# EAGLE schematic Order (EAGLE 9.5.0)
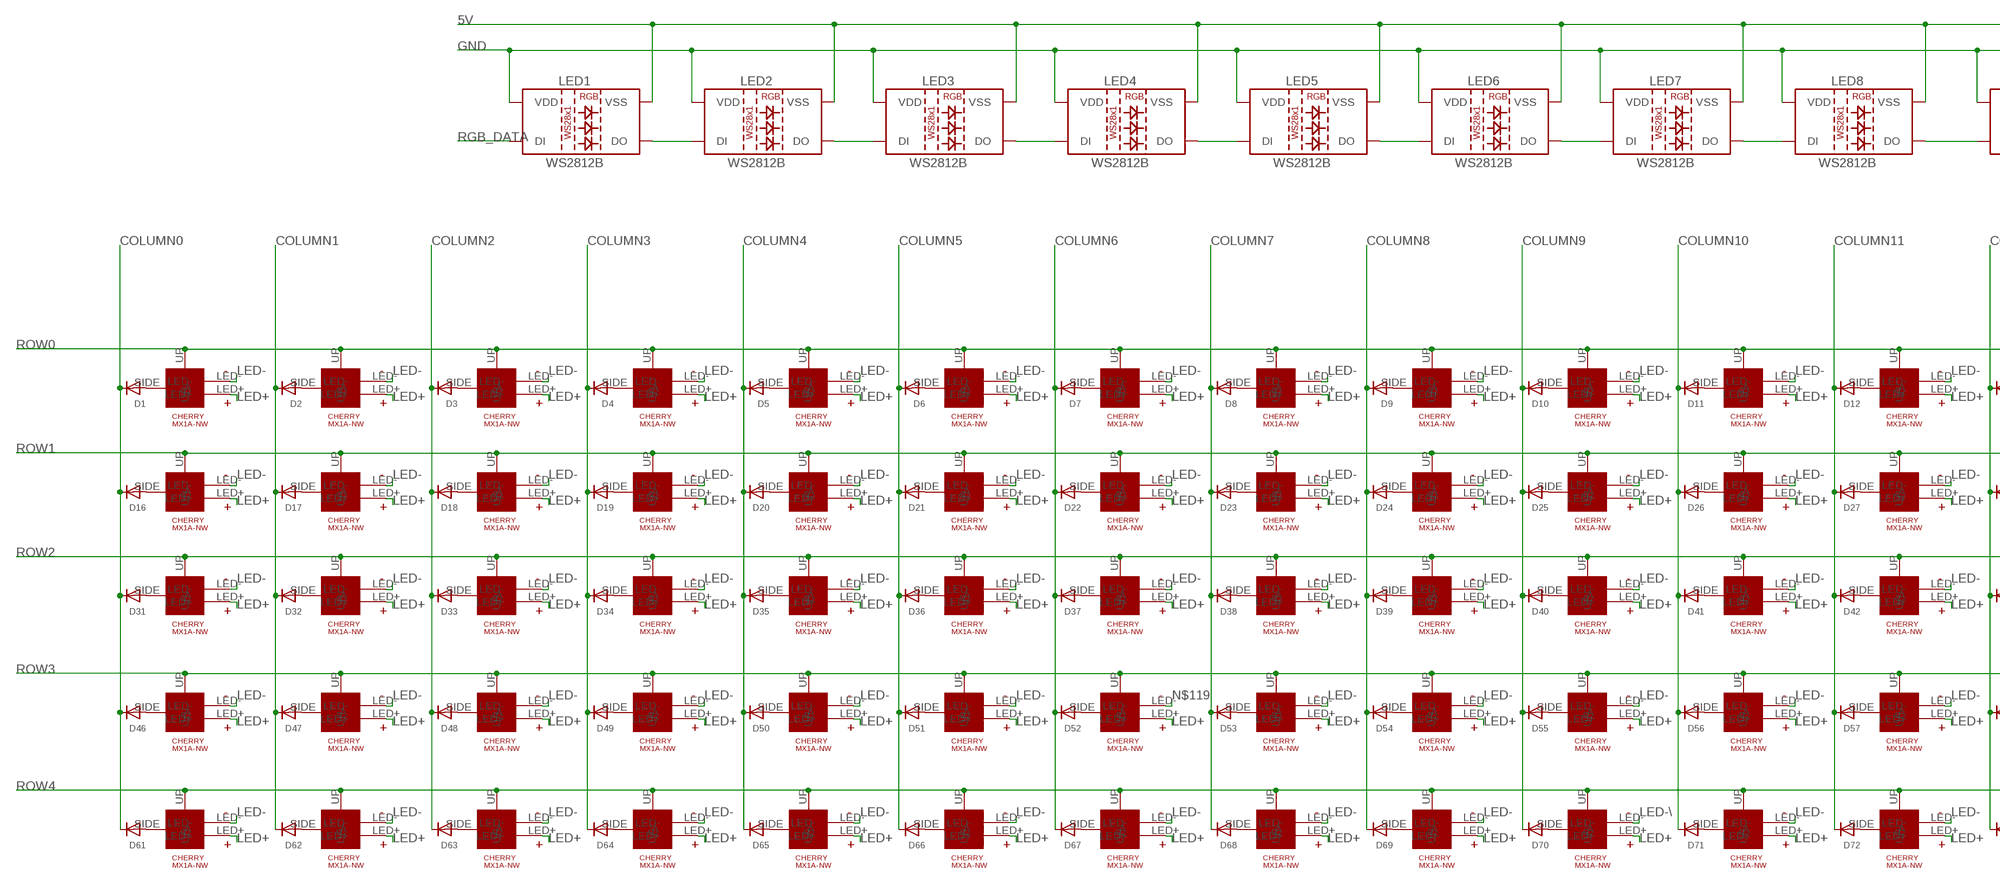
[diagram p0: schematic, sheet 1, part 1 of 2]
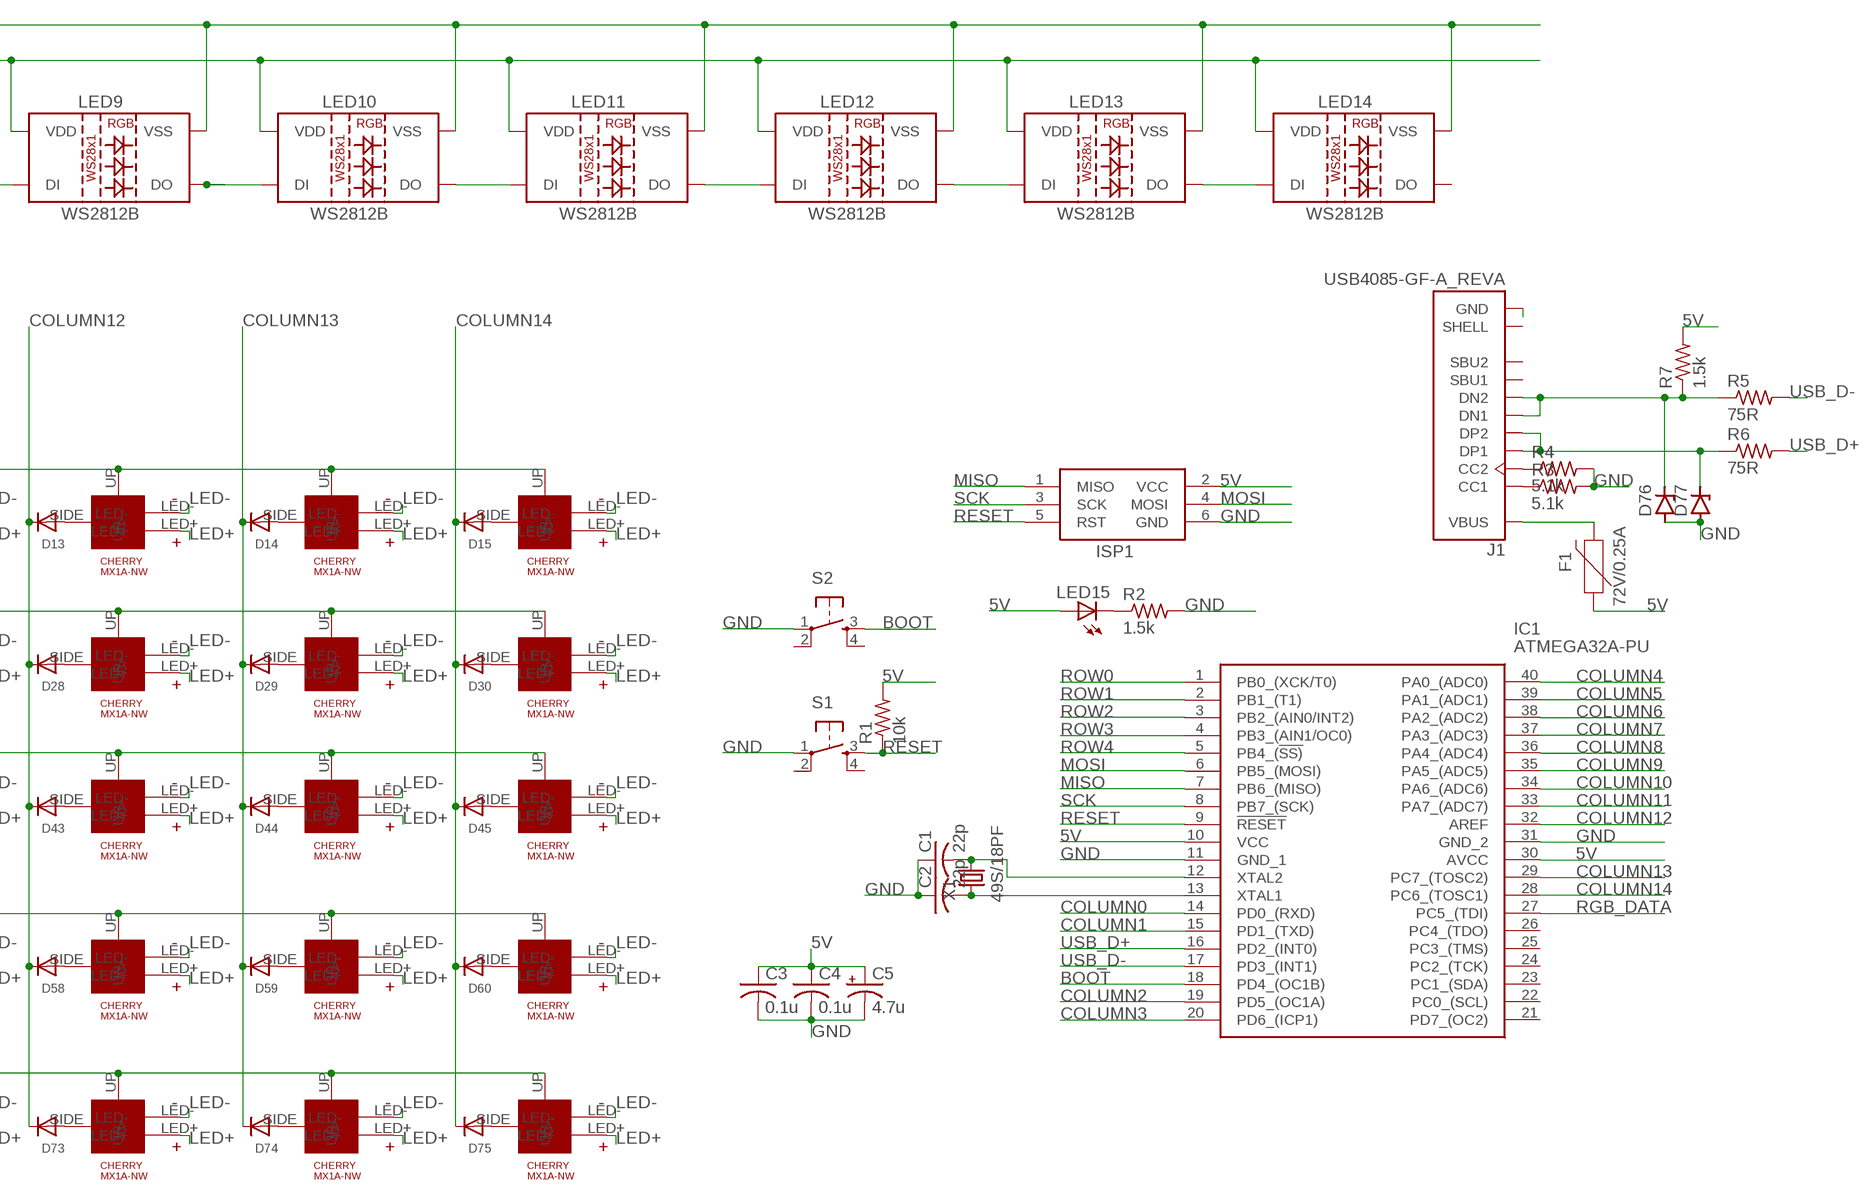
[diagram p1: schematic, sheet 1, part 2 of 2]

## Parts
C1  22p  C-US025-025X050  [C025-025X050]
C2  22p  C-US025-025X050  [C025-025X050]
C3  0.1u  C-US025-025X050  [C025-025X050]
C4  0.1u  C-US025-025X050  [C025-025X050]
C5  4.7u  CPOL-USE2-4  [E2-4]
D1  DIODEDO-1N4148  [DO-1N4148]
D2  DIODEDO-1N4148  [DO-1N4148]
D3  DIODEDO-1N4148  [DO-1N4148]
D4  DIODEDO-1N4148  [DO-1N4148]
D5  DIODEDO-1N4148  [DO-1N4148]
D6  DIODEDO-1N4148  [DO-1N4148]
D7  DIODEDO-1N4148  [DO-1N4148]
D8  DIODEDO-1N4148  [DO-1N4148]
D9  DIODEDO-1N4148  [DO-1N4148]
D10  DIODEDO-1N4148  [DO-1N4148]
D11  DIODEDO-1N4148  [DO-1N4148]
D12  DIODEDO-1N4148  [DO-1N4148]
D13  DIODEDO-1N4148  [DO-1N4148]
D14  DIODEDO-1N4148  [DO-1N4148]
D15  DIODEDO-1N4148  [DO-1N4148]
D16  DIODEDO-1N4148  [DO-1N4148]
D17  DIODEDO-1N4148  [DO-1N4148]
D18  DIODEDO-1N4148  [DO-1N4148]
D19  DIODEDO-1N4148  [DO-1N4148]
D20  DIODEDO-1N4148  [DO-1N4148]
D21  DIODEDO-1N4148  [DO-1N4148]
D22  DIODEDO-1N4148  [DO-1N4148]
D23  DIODEDO-1N4148  [DO-1N4148]
D24  DIODEDO-1N4148  [DO-1N4148]
D25  DIODEDO-1N4148  [DO-1N4148]
D26  DIODEDO-1N4148  [DO-1N4148]
D27  DIODEDO-1N4148  [DO-1N4148]
D28  DIODEDO-1N4148  [DO-1N4148]
D29  DIODEDO-1N4148  [DO-1N4148]
D30  DIODEDO-1N4148  [DO-1N4148]
D31  DIODEDO-1N4148  [DO-1N4148]
D32  DIODEDO-1N4148  [DO-1N4148]
D33  DIODEDO-1N4148  [DO-1N4148]
D34  DIODEDO-1N4148  [DO-1N4148]
D35  DIODEDO-1N4148  [DO-1N4148]
D36  DIODEDO-1N4148  [DO-1N4148]
D37  DIODEDO-1N4148  [DO-1N4148]
D38  DIODEDO-1N4148  [DO-1N4148]
D39  DIODEDO-1N4148  [DO-1N4148]
D40  DIODEDO-1N4148  [DO-1N4148]
D41  DIODEDO-1N4148  [DO-1N4148]
D42  DIODEDO-1N4148  [DO-1N4148]
D43  DIODEDO-1N4148  [DO-1N4148]
D44  DIODEDO-1N4148  [DO-1N4148]
D45  DIODEDO-1N4148  [DO-1N4148]
D46  DIODEDO-1N4148  [DO-1N4148]
D47  DIODEDO-1N4148  [DO-1N4148]
D48  DIODEDO-1N4148  [DO-1N4148]
D49  DIODEDO-1N4148  [DO-1N4148]
D50  DIODEDO-1N4148  [DO-1N4148]
D51  DIODEDO-1N4148  [DO-1N4148]
D52  DIODEDO-1N4148  [DO-1N4148]
D53  DIODEDO-1N4148  [DO-1N4148]
D54  DIODEDO-1N4148  [DO-1N4148]
D55  DIODEDO-1N4148  [DO-1N4148]
D56  DIODEDO-1N4148  [DO-1N4148]
D57  DIODEDO-1N4148  [DO-1N4148]
D58  DIODEDO-1N4148  [DO-1N4148]
D59  DIODEDO-1N4148  [DO-1N4148]
D60  DIODEDO-1N4148  [DO-1N4148]
D61  DIODEDO-1N4148  [DO-1N4148]
D62  DIODEDO-1N4148  [DO-1N4148]
D63  DIODEDO-1N4148  [DO-1N4148]
D64  DIODEDO-1N4148  [DO-1N4148]
D65  DIODEDO-1N4148  [DO-1N4148]
D66  DIODEDO-1N4148  [DO-1N4148]
D67  DIODEDO-1N4148  [DO-1N4148]
D68  DIODEDO-1N4148  [DO-1N4148]
D69  DIODEDO-1N4148  [DO-1N4148]
D70  DIODEDO-1N4148  [DO-1N4148]
D71  DIODEDO-1N4148  [DO-1N4148]
D72  DIODEDO-1N4148  [DO-1N4148]
D73  DIODEDO-1N4148  [DO-1N4148]
D74  DIODEDO-1N4148  [DO-1N4148]
D75  DIODEDO-1N4148  [DO-1N4148]
D76  ZENER-DIODEDO34-7  [DO34Z7]
D77  ZENER-DIODEDO34-7  [DO34Z7]
F1  72V/0.25A  PPTC_PTH  [PTH]
IC1  ATMEGA32A-PU  [DIP1556W56P254L5232H483Q40N]
ISP1  AVRISP-6  [AVRISP]
J1  USB4085-GF-A_REVA  [GCT_USB4085-GF-A_REVA]
LED1  WS2812B  [WS2812B]
LED2  WS2812B  [WS2812B]
LED3  WS2812B  [WS2812B]
LED4  WS2812B  [WS2812B]
LED5  WS2812B  [WS2812B]
LED6  WS2812B  [WS2812B]
LED7  WS2812B  [WS2812B]
LED8  WS2812B  [WS2812B]
LED9  WS2812B  [WS2812B]
LED10  WS2812B  [WS2812B]
LED11  WS2812B  [WS2812B]
LED12  WS2812B  [WS2812B]
LED13  WS2812B  [WS2812B]
LED14  WS2812B  [WS2812B]
LED15  LED3MM  [LED3MM]
R1  10k  R-US_0207/9  [0207/9]
R2  1.5k  R-US_0207/9  [0207/9]
R3  5.1k  R-US_0207/9  [0207/9]
R4  5.1k  R-US_0207/9  [0207/9]
R5  75R  R-US_0207/9  [0207/9]
R6  75R  R-US_0207/9  [0207/9]
R7  1.5k  R-US_0207/9  [0207/9]
S1  TAC_SWITCHPTH  [TACTILE-PTH]
S2  TAC_SWITCHPTH  [TACTILE-PTH]
U$1  CHERRY-MX1A-E1NW-LED  [CHERRYMX-NN-LED]
U$2  CHERRY-MX1A-E1NW-LED  [CHERRYMX-NN-LED]
U$3  CHERRY-MX1A-E1NW-LED  [CHERRYMX-NN-LED]
U$4  CHERRY-MX1A-E1NW-LED  [CHERRYMX-NN-LED]
U$5  CHERRY-MX1A-E1NW-LED  [CHERRYMX-NN-LED]
U$6  CHERRY-MX1A-E1NW-LED  [CHERRYMX-NN-LED]
U$7  CHERRY-MX1A-E1NW-LED  [CHERRYMX-NN-LED]
U$8  CHERRY-MX1A-E1NW-LED  [CHERRYMX-NN-LED]
U$9  CHERRY-MX1A-E1NW-LED  [CHERRYMX-NN-LED]
U$10  CHERRY-MX1A-E1NW-LED  [CHERRYMX-NN-LED]
U$11  CHERRY-MX1A-E1NW-LED  [CHERRYMX-NN-LED]
U$12  CHERRY-MX1A-E1NW-LED  [CHERRYMX-NN-LED]
U$13  CHERRY-MX1A-E1NW-LED  [CHERRYMX-NN-LED]
U$14  CHERRY-MX1A-E1NW-LED  [CHERRYMX-NN-LED]
U$15  CHERRY-MX1A-E1NW-LED  [CHERRYMX-NN-LED]
U$16  CHERRY-MX1A-E1NW-LED  [CHERRYMX-NN-LED]
U$17  CHERRY-MX1A-E1NW-LED  [CHERRYMX-NN-LED]
U$18  CHERRY-MX1A-E1NW-LED  [CHERRYMX-NN-LED]
U$19  CHERRY-MX1A-E1NW-LED  [CHERRYMX-NN-LED]
U$20  CHERRY-MX1A-E1NW-LED  [CHERRYMX-NN-LED]
U$21  CHERRY-MX1A-E1NW-LED  [CHERRYMX-NN-LED]
U$22  CHERRY-MX1A-E1NW-LED  [CHERRYMX-NN-LED]
U$23  CHERRY-MX1A-E1NW-LED  [CHERRYMX-NN-LED]
U$24  CHERRY-MX1A-E1NW-LED  [CHERRYMX-NN-LED]
U$25  CHERRY-MX1A-E1NW-LED  [CHERRYMX-NN-LED]
U$26  CHERRY-MX1A-E1NW-LED  [CHERRYMX-NN-LED]
U$27  CHERRY-MX1A-E1NW-LED  [CHERRYMX-NN-LED]
U$28  CHERRY-MX1A-E1NW-LED  [CHERRYMX-NN-LED]
U$29  CHERRY-MX1A-E1NW-LED  [CHERRYMX-NN-LED]
U$30  CHERRY-MX1A-E1NW-LED  [CHERRYMX-NN-LED]
U$31  CHERRY-MX1A-E1NW-LED  [CHERRYMX-NN-LED]
U$32  CHERRY-MX1A-E1NW-LED  [CHERRYMX-NN-LED]
U$33  CHERRY-MX1A-E1NW-LED  [CHERRYMX-NN-LED]
U$34  CHERRY-MX1A-E1NW-LED  [CHERRYMX-NN-LED]
U$35  CHERRY-MX1A-E1NW-LED  [CHERRYMX-NN-LED]
U$36  CHERRY-MX1A-E1NW-LED  [CHERRYMX-NN-LED]
U$37  CHERRY-MX1A-E1NW-LED  [CHERRYMX-NN-LED]
U$38  CHERRY-MX1A-E1NW-LED  [CHERRYMX-NN-LED]
U$39  CHERRY-MX1A-E1NW-LED  [CHERRYMX-NN-LED]
U$40  CHERRY-MX1A-E1NW-LED  [CHERRYMX-NN-LED]
U$41  CHERRY-MX1A-E1NW-LED  [CHERRYMX-NN-LED]
U$42  CHERRY-MX1A-E1NW-LED  [CHERRYMX-NN-LED]
U$43  CHERRY-MX1A-E1NW-LED  [CHERRYMX-NN-LED]
U$44  CHERRY-MX1A-E1NW-LED  [CHERRYMX-NN-LED]
U$45  CHERRY-MX1A-E1NW-LED  [CHERRYMX-NN-LED]
U$46  CHERRY-MX1A-E1NW-LED  [CHERRYMX-NN-LED]
U$47  CHERRY-MX1A-E1NW-LED  [CHERRYMX-NN-LED]
U$48  CHERRY-MX1A-E1NW-LED  [CHERRYMX-NN-LED]
U$49  CHERRY-MX1A-E1NW-LED  [CHERRYMX-NN-LED]
U$50  CHERRY-MX1A-E1NW-LED  [CHERRYMX-NN-LED]
U$51  CHERRY-MX1A-E1NW-LED  [CHERRYMX-NN-LED]
U$52  CHERRY-MX1A-E1NW-LED  [CHERRYMX-NN-LED]
U$53  CHERRY-MX1A-E1NW-LED  [CHERRYMX-NN-LED]
U$54  CHERRY-MX1A-E1NW-LED  [CHERRYMX-NN-LED]
U$55  CHERRY-MX1A-E1NW-LED  [CHERRYMX-NN-LED]
U$56  CHERRY-MX1A-E1NW-LED  [CHERRYMX-NN-LED]
U$57  CHERRY-MX1A-E1NW-LED  [CHERRYMX-NN-LED]
U$58  CHERRY-MX1A-E1NW-LED  [CHERRYMX-NN-LED]
U$59  CHERRY-MX1A-E1NW-LED  [CHERRYMX-NN-LED]
U$60  CHERRY-MX1A-E1NW-LED  [CHERRYMX-NN-LED]
U$61  CHERRY-MX1A-E1NW-LED  [CHERRYMX-NN-LED]
U$62  CHERRY-MX1A-E1NW-LED  [CHERRYMX-NN-LED]
U$63  CHERRY-MX1A-E1NW-LED  [CHERRYMX-NN-LED]
U$64  CHERRY-MX1A-E1NW-LED  [CHERRYMX-NN-LED]
U$65  CHERRY-MX1A-E1NW-LED  [CHERRYMX-NN-LED]
U$66  CHERRY-MX1A-E1NW-LED  [CHERRYMX-NN-LED]
U$67  CHERRY-MX1A-E1NW-LED  [CHERRYMX-NN-LED]
U$68  CHERRY-MX1A-E1NW-LED  [CHERRYMX-NN-LED]
U$69  CHERRY-MX1A-E1NW-LED  [CHERRYMX-NN-LED]
U$70  CHERRY-MX1A-E1NW-LED  [CHERRYMX-NN-LED]
U$71  CHERRY-MX1A-E1NW-LED  [CHERRYMX-NN-LED]
U$72  CHERRY-MX1A-E1NW-LED  [CHERRYMX-NN-LED]
U$73  CHERRY-MX1A-E1NW-LED  [CHERRYMX-NN-LED]
U$74  CHERRY-MX1A-E1NW-LED  [CHERRYMX-NN-LED]
U$75  CHERRY-MX1A-E1NW-LED  [CHERRYMX-NN-LED]
X1  49S/18PF  [XTAL_HC49]

## Nets
5V: C3.1 C4.1 C5.+ F1.P$1 IC1.10(VCC) IC1.30(AVCC) ISP1.2(VCC) LED1.3(VSS) LED2.3(VSS) LED3.3(VSS) LED4.3(VSS) LED5.3(VSS) LED6.3(VSS) LED7.3(VSS) LED8.3(VSS) LED9.3(VSS) LED10.3(VSS) LED11.3(VSS) LED12.3(VSS) LED13.3(VSS) LED14.3(VSS) LED15.A R1.2 R7.2
BOOT: IC1.18(PD4_(OC1B)) S2.3
COLUMN0: D1.C D16.C D31.C D46.C D61.C IC1.14(PD0_(RXD))
COLUMN1: D2.C D17.C D32.C D47.C D62.C IC1.15(PD1_(TXD))
COLUMN2: D3.C D18.C D33.C D48.C D63.C IC1.19(PD5_(OC1A))
COLUMN3: D4.C D19.C D34.C D49.C D64.C IC1.20(PD6_(ICP1))
COLUMN4: D5.C D20.C D35.C D50.C D65.C IC1.40(PA0_(ADC0))
COLUMN5: D6.C D21.C D36.C D51.C D66.C IC1.39(PA1_(ADC1))
COLUMN6: D7.C D22.C D37.C D52.C D67.C IC1.38(PA2_(ADC2))
COLUMN7: D8.C D23.C D38.C D53.C D68.C IC1.37(PA3_(ADC3))
COLUMN8: D9.C D24.C D39.C D54.C D69.C IC1.36(PA4_(ADC4))
COLUMN9: D10.C D25.C D40.C D55.C D70.C IC1.35(PA5_(ADC5))
COLUMN10: D11.C D26.C D41.C D56.C D71.C IC1.34(PA6_(ADC6))
COLUMN11: D12.C D27.C D42.C D57.C D72.C IC1.33(PA7_(ADC7))
COLUMN12: D13.C D28.C D43.C D58.C D73.C IC1.32(AREF)
COLUMN13: D14.C D29.C D44.C D59.C D74.C IC1.29(PC7_(TOSC2))
COLUMN14: D15.C D30.C D45.C D60.C D75.C IC1.28(PC6_(TOSC1))
GND: C1.1 C2.1 C3.2 C4.2 C5.- D76.A D77.A IC1.11(GND_1) IC1.31(GND_2) ISP1.6(GND) LED1.1(VDD) LED2.1(VDD) LED3.1(VDD) LED4.1(VDD) LED5.1(VDD) LED6.1(VDD) LED7.1(VDD) LED8.1(VDD) LED9.1(VDD) LED10.1(VDD) LED11.1(VDD) LED12.1(VDD) LED13.1(VDD) LED14.1(VDD) R2.2 R3.2 R4.2 S1.1 S2.1
LED+: U$1.LED+ U$2.LED+ U$3.LED+ U$4.LED+ U$5.LED+ U$6.LED+ U$7.LED+ U$8.LED+ U$9.LED+ U$10.LED+ U$11.LED+ U$12.LED+ U$13.LED+ U$14.LED+ U$15.LED+ U$16.LED+ U$17.LED+ U$18.LED+ U$19.LED+ U$20.LED+ U$21.LED+ U$22.LED+ U$23.LED+ U$24.LED+ U$25.LED+ U$26.LED+ U$27.LED+ U$28.LED+ U$29.LED+ U$30.LED+ U$31.LED+ U$32.LED+ U$33.LED+ U$34.LED+ U$35.LED+ U$36.LED+ U$37.LED+ U$38.LED+ U$39.LED+ U$40.LED+ U$41.LED+ U$42.LED+ U$43.LED+ U$44.LED+ U$45.LED+ U$46.LED+ U$47.LED+ U$48.LED+ U$49.LED+ U$50.LED+ U$51.LED+ U$52.LED+ U$53.LED+ U$54.LED+ U$55.LED+ U$56.LED+ U$57.LED+ U$58.LED+ U$59.LED+ U$60.LED+ U$61.LED+ U$62.LED+ U$63.LED+ U$64.LED+ U$65.LED+ U$66.LED+ U$67.LED+ U$68.LED+ U$69.LED+ U$70.LED+ U$71.LED+ U$72.LED+ U$73.LED+ U$74.LED+ U$75.LED+
LED-: U$1.LED- U$2.LED- U$3.LED- U$4.LED- U$5.LED- U$6.LED- U$7.LED- U$8.LED- U$9.LED- U$10.LED- U$11.LED- U$12.LED- U$13.LED- U$14.LED- U$15.LED- U$16.LED- U$17.LED- U$18.LED- U$19.LED- U$20.LED- U$21.LED- U$22.LED- U$23.LED- U$24.LED- U$25.LED- U$26.LED- U$27.LED- U$28.LED- U$29.LED- U$30.LED- U$31.LED- U$32.LED- U$33.LED- U$34.LED- U$35.LED- U$36.LED- U$37.LED- U$38.LED- U$39.LED- U$40.LED- U$41.LED- U$42.LED- U$43.LED- U$44.LED- U$45.LED- U$46.LED- U$47.LED- U$48.LED- U$49.LED- U$50.LED- U$51.LED- U$53.LED- U$54.LED- U$55.LED- U$56.LED- U$57.LED- U$58.LED- U$59.LED- U$60.LED- U$61.LED- U$62.LED- U$63.LED- U$64.LED- U$65.LED- U$66.LED- U$67.LED- U$68.LED- U$69.LED- U$71.LED- U$72.LED- U$73.LED- U$74.LED- U$75.LED-
LED-\: U$70.LED-
MISO: IC1.7(PB6_(MISO)) ISP1.1(MISO)
MOSI: IC1.6(PB5_(MOSI)) ISP1.4(MOSI)
N$1: D1.A U$1.SIDE(A)
N$2: D2.A U$2.SIDE(A)
N$3: D3.A U$3.SIDE(A)
N$4: D4.A U$4.SIDE(A)
N$5: D5.A U$5.SIDE(A)
N$6: D6.A U$6.SIDE(A)
N$7: D7.A U$7.SIDE(A)
N$8: D8.A U$8.SIDE(A)
N$9: D9.A U$9.SIDE(A)
N$10: D10.A U$10.SIDE(A)
N$11: D11.A U$11.SIDE(A)
N$12: D12.A U$12.SIDE(A)
N$13: D13.A U$13.SIDE(A)
N$14: D14.A U$14.SIDE(A)
N$15: D15.A U$15.SIDE(A)
N$16: D16.A U$16.SIDE(A)
N$17: D17.A U$17.SIDE(A)
N$18: D18.A U$18.SIDE(A)
N$19: D19.A U$19.SIDE(A)
N$20: D20.A U$20.SIDE(A)
N$21: D21.A U$21.SIDE(A)
N$22: D22.A U$22.SIDE(A)
N$23: D23.A U$23.SIDE(A)
N$24: D24.A U$24.SIDE(A)
N$25: D25.A U$25.SIDE(A)
N$26: D26.A U$26.SIDE(A)
N$27: D27.A U$27.SIDE(A)
N$28: D28.A U$28.SIDE(A)
N$29: D29.A U$29.SIDE(A)
N$30: D30.A U$30.SIDE(A)
N$31: D31.A U$31.SIDE(A)
N$32: D32.A U$32.SIDE(A)
N$33: D33.A U$33.SIDE(A)
N$34: D34.A U$34.SIDE(A)
N$35: D35.A U$35.SIDE(A)
N$36: D36.A U$36.SIDE(A)
N$37: D37.A U$37.SIDE(A)
N$38: D38.A U$38.SIDE(A)
N$39: D39.A U$39.SIDE(A)
N$40: D40.A U$40.SIDE(A)
N$41: LED1.2(DO) LED2.4(DI)
N$42: LED2.2(DO) LED3.4(DI)
N$43: C1.2 IC1.12(XTAL2) X1.2
N$44: C2.2 IC1.13(XTAL1) X1.1
N$45: LED15.K(C) R2.1
N$46: LED3.2(DO) LED4.4(DI)
N$47: LED4.2(DO) LED5.4(DI)
N$48: LED5.2(DO) LED6.4(DI)
N$49: LED6.2(DO) LED7.4(DI)
N$50: LED7.2(DO) LED8.4(DI)
N$51: LED8.2(DO) LED9.4(DI)
N$52: LED9.2(DO) LED10.4(DI)
N$53: LED10.2(DO) LED11.4(DI)
N$54: D41.A U$41.SIDE(A)
N$55: D42.A U$42.SIDE(A)
N$56: D43.A U$43.SIDE(A)
N$57: D44.A U$44.SIDE(A)
N$58: D45.A U$45.SIDE(A)
N$59: D46.A U$46.SIDE(A)
N$60: D47.A U$47.SIDE(A)
N$61: D48.A U$48.SIDE(A)
N$62: D49.A U$49.SIDE(A)
N$63: D50.A U$50.SIDE(A)
N$64: D51.A U$51.SIDE(A)
N$65: D52.A U$52.SIDE(A)
N$66: D53.A U$53.SIDE(A)
N$67: D54.A U$54.SIDE(A)
N$68: D55.A U$55.SIDE(A)
N$69: D56.A U$56.SIDE(A)
N$70: D57.A U$57.SIDE(A)
N$71: D58.A U$58.SIDE(A)
N$72: D59.A U$59.SIDE(A)
N$73: D60.A U$60.SIDE(A)
N$74: D61.A U$61.SIDE(A)
N$75: D62.A U$62.SIDE(A)
N$76: D63.A U$63.SIDE(A)
N$77: D64.A U$64.SIDE(A)
N$78: D65.A U$65.SIDE(A)
N$79: D66.A U$66.SIDE(A)
N$80: D67.A U$67.SIDE(A)
N$81: D68.A U$68.SIDE(A)
N$82: D69.A U$69.SIDE(A)
N$83: D70.A U$70.SIDE(A)
N$84: D71.A U$71.SIDE(A)
N$85: D72.A U$72.SIDE(A)
N$86: D73.A U$73.SIDE(A)
N$87: D74.A U$74.SIDE(A)
N$88: D75.A U$75.SIDE(A)
N$89: LED11.2(DO) LED12.4(DI)
N$90: LED12.2(DO) LED13.4(DI)
N$91: LED13.2(DO) LED14.4(DI)
N$92: J1.A1(GND) J1.A12(GND) J1.B1(GND) J1.B12(GND)
N$93: F1.P$2 J1.A4(VBUS) J1.A9(VBUS) J1.B4(VBUS) J1.B9(VBUS)
N$94: J1.P1(SHELL) J1.P2(SHELL) J1.P3(SHELL) J1.P4(SHELL)
N$95: J1.A5(CC1) R3.1
N$96: D76.C J1.A7(DN1) J1.B7(DN2) R5.1 R7.1
N$97: D77.C J1.A6(DP1) J1.B6(DP2) R6.1
N$98: J1.B5(CC2) R4.1
N$119: U$52.LED-
RESET: IC1.9(!RESET) ISP1.5(RST) R1.1 S1.3
RGB_DATA: IC1.27(PC5_(TDI)) LED1.4(DI)
ROW0: IC1.1(PB0_(XCK/T0)) U$1.UP U$2.UP U$3.UP U$4.UP U$5.UP U$6.UP U$7.UP U$8.UP U$9.UP U$10.UP U$11.UP U$12.UP U$13.UP U$14.UP U$15.UP
ROW1: IC1.2(PB1_(T1)) U$16.UP U$17.UP U$18.UP U$19.UP U$20.UP U$21.UP U$22.UP U$23.UP U$24.UP U$25.UP U$26.UP U$27.UP U$28.UP U$29.UP U$30.UP
ROW2: IC1.3(PB2_(AIN0/INT2)) U$31.UP U$32.UP U$33.UP U$34.UP U$35.UP U$36.UP U$37.UP U$38.UP U$39.UP U$40.UP U$41.UP U$42.UP U$43.UP U$44.UP U$45.UP
ROW3: IC1.4(PB3_(AIN1/OC0)) U$46.UP U$47.UP U$48.UP U$49.UP U$50.UP U$51.UP U$52.UP U$53.UP U$54.UP U$55.UP U$56.UP U$57.UP U$58.UP U$59.UP U$60.UP
ROW4: IC1.5(PB4_(!SS)) U$61.UP U$62.UP U$63.UP U$64.UP U$65.UP U$66.UP U$67.UP U$68.UP U$69.UP U$70.UP U$71.UP U$72.UP U$73.UP U$74.UP U$75.UP
SCK: IC1.8(PB7_(SCK)) ISP1.3(SCK)
USB_D+: IC1.16(PD2_(INT0)) R6.2
USB_D-: IC1.17(PD3_(INT1)) R5.2
Unconnected: IC1.21(PD7_(OC2)) IC1.22(PC0_(SCL)) IC1.23(PC1_(SDA)) IC1.24(PC2_(TCK)) IC1.25(PC3_(TMS)) IC1.26(PC4_(TDO)) J1.A8(SBU1) J1.B8(SBU2) LED14.2(DO) S1.2 S1.4 S2.2 S2.4

## Library data of the parts
C1-C4 = adafruit:C-US: CAPACITOR, American symbol
C5 = adafruit:CPOL-US: POLARIZED CAPACITOR, American symbol
D1-D75 = adafruit:DIODE: Diode SMADIODE - SMA Surface Mount Package 20V 1A Schottky Diode Digikey: 641-1014-6-ND DO-1N4148 - Through Hole Small Current Diode SOD-123 20V 1 A (.5mV Vf) Schottky Diode - Digikey: MBRX120TPMSCT-ND SOD-323 10V 570mA (.38mV Vf, 3ns) Schottky Diode - Digikey: ZLLS410CT-ND SOD-523 30V 30mA Schottky Diode (RB751S-40TE61) - Digikey: RB751S-40TE61CT-ND SOT23-R/W - SOT23 Package (R = Solder Paste/Reflow Ovens, W = Hand-Soldering) BAT54Film 40V 300mA - Digikey: 497-7162-1-ND
D76 D77 = diode:ZENER-DIODE: Z-Diode
F1 = SparkFun-Fuses:PPTC: Resettable Fuse PPTC Resettable Fuse. Really a sort of resistor with a polymeric positive temperature coefficient whose resistance increases dramatically with an increase in temperature. When heated by the power passing through the resistance rises causing the current to be limited, protecting the circuit. This is achieved by the transition of the polymer from a crystalline to an amorphous state where the conductive carbon separates breaking the conductive pathways found in the cool crystalline structure. When a PPTC cools back down it resumes conducting letting the circuit turn back on. SparkFun Products: SparkFun RedBoard - Programmed with Arduino <https://www.sparkfun.com/products/12757> Pro Micro - 5V/16MHz <https://www.sparkfun.com/products/12640> Arduino Pro 328 - 5V/16MHz <https://www.sparkfun.com/products/10915> MP3 Trigger <https://www.sparkfun.com/products/13720>; PROD_ID: RES-08490
IC1 = ATMEGA32A-PU:ATMEGA32A-PU: 8-bit Microcontrollers - MCU 32KB In-system Flash 2.7V - 5.5V Source: Datasheet <https://componentsearchengine.com/Datasheets/1/ATMEGA32A-PU.pdf>; DESCRIPTION: 8-bit Microcontrollers - MCU 32KB In-system Flash 2.7V - 5.5V; HEIGHT: 4.826mm; MANUFACTURER_NAME: Microchip; MANUFACTURER_PART_NUMBER: ATMEGA32A-PU; MOUSER_PART_NUMBER: 556-ATMEGA32A-PU; MOUSER_PRICE-STOCK: https://www.mouser.com/Search/Refine.aspx?Keyword=556-ATMEGA32A-PU
ISP1 = adafruit:AVRISP: AVR ISP HEADER Standard 6 pin header for AVR programming
J1 = USB4085-GF-A_REVA:USB4085-GF-A_REVA: USB 2.0 Type C Receptacle Dip Type, PCB Top Mount; DESCRIPTION: CONN RCPT USB2.0 TYPEC 16POS; DIGI-KEY_PART_NUMBER: 2073-USB4085-GF-ACT-ND; DIGI-KEY_PURCHASE_URL: https://www.digikey.de/product-detail/en/gct/USB4085-GF-A/2073-USB4085-GF-ACT-ND/9859733?utm_source=snapeda&utm_medium=aggregator&utm_campaign=symbol; MF: Global Connector Technology; MP: USB4085-GF-A; PACKAGE: Package Analog Devices
LED1-LED14 = SparkFun-LED:WS2812B: WS2812B SMD addressable RGB LED 5x5mm SMD LED with built-in controller IC. Color: Red/Green/Blue mC Rating: RGB: 390, 660, 180 mcd Forward Voltage: RGB: 2.0, 3.0, 3.0 V Packages:WS2812B SparkFun Products: Blynk Board - ESP8266 <https://www.sparkfun.com/products/13794>; PROD_ID: DIO-12503
LED15 = adafruit:LED: LED OSRAM: - CHIPLED LG R971, LG N971, LY N971, LG Q971, LY Q971, LO R971, LY R971 LH N974, LH R974 LS Q976, LO Q976, LY Q976 LO Q996 - Hyper CHIPLED LW Q18S LB Q993, LB Q99A, LB R99A - SideLED LS A670, LO A670, LY A670, LG A670, LP A670 LB A673, LV A673, LT A673, LW A673 LH A674 LY A675 LS A676, LA A676, LO A676, LY A676, LW A676 LS A679, LY A679, LG A679 - Hyper Micro SIDELED® LS Y876, LA Y876, LO Y876, LY Y876 LT Y87S - SmartLED LW L88C, LW L88S LB L89C, LB L89S, LG L890 LS L89K, LO L89K, LY L89K LS L896, LA L896, LO L896, LY L896 - TOPLED LS T670, LO T670, LY T670, LG T670, LP T670 LSG T670, LSP T670, LSY T670, LOP T670, LYG T670 LG T671, LOG T671, LSG T671 LB T673, LV T673, LT T673, LW T673 LH T674 LS T676, LA T676, LO T676, LY T676, LB T676, LH T676, LSB T676, LW T676 LB T67C, LV T67C, LT T67C, LS T67K, LO T67K, LY T67K, LW E67C LS E67B, LA E67B, LO E67B, LY E67B, LB E67C, LV E67C, LT E67C LW T67C LS T679, LY T679, LG T679 LS T770, LO T770, LY T770, LG T770, LP T770 LB T773, LV T773, LT T773, LW T773 LH T774 LS E675, LA E675, LY E675, LS T675 LS T776, LA T776, LO T776, LY T776, LB T776 LHGB T686 LT T68C, LB T68C - Hyper Mini TOPLED® LB M676 - Mini TOPLED Santana® LG M470 LS M47K, LO M47K, LY M47K Source: http://www.osram.convergy.de/
R1-R7 = adafruit:R-US_: RESISTOR, American symbol
S1 S2 = SparkFun-Retired:TAC_SWITCH: Momentary Switch Button commonly used for reset or general input. Spark Fun Electronics SKU : COM-00097 SMT- SWCH-08247
U$1-U$75 = my_parts:CHERRY-MX1A-E1NW-LED: A cherry MX NW switch, but also with a place to put a LED
X1 = Crystals:49S/18PF: Crystal Manufacturer's datasheet <https://datasheet.octopart.com/49S-18PF-Xinhunjing-datasheet-30677139.pdf>; CREATED_BY: PCBLayout.com; MANUFACTURER: Xinhunjing; MPN: 49S/18PF; PACKAGE: SMD